# EAGLE design Tecleator (EAGLE 6.5.0)
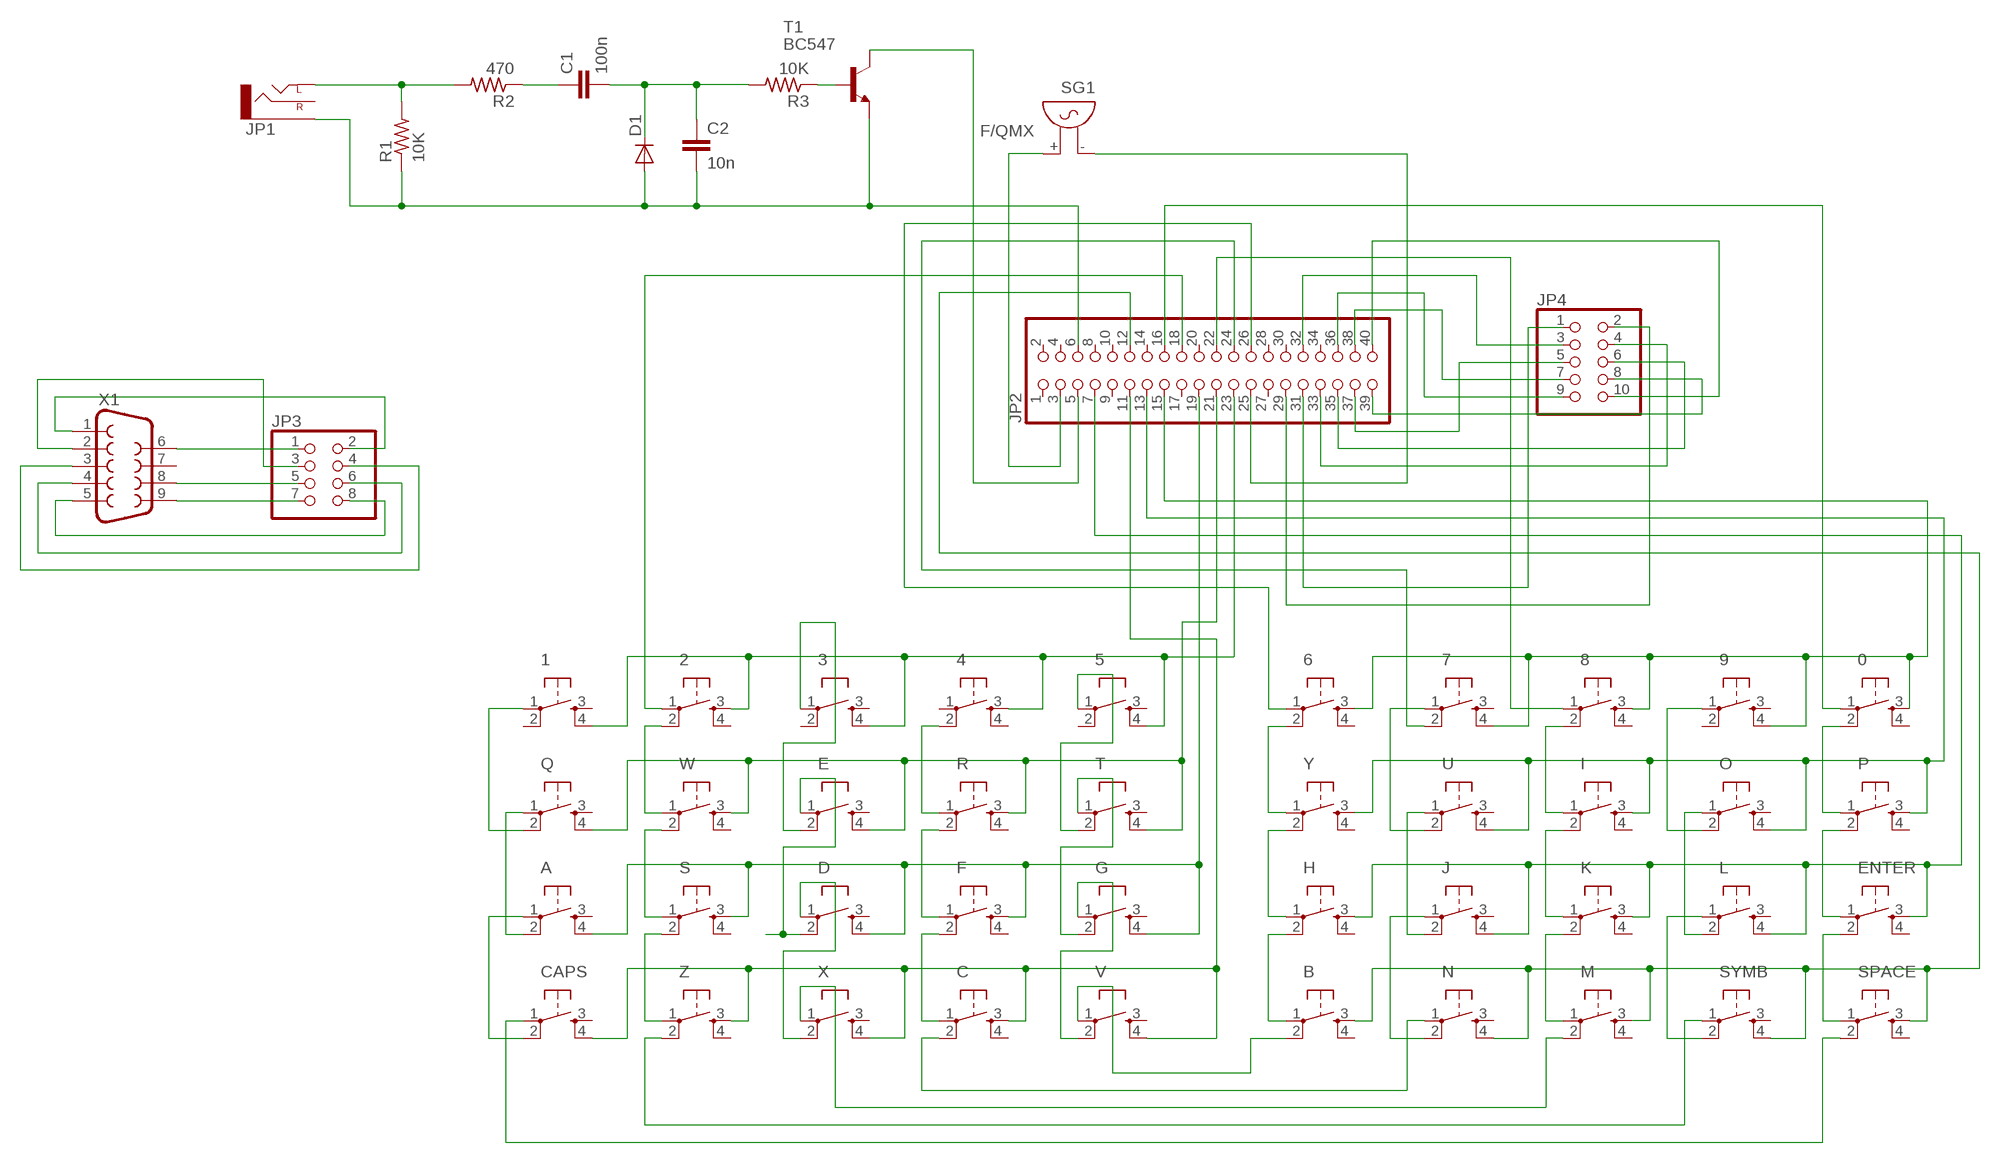
[diagram p0: schematic, sheet 1]

## Parts
0  DTS-6  [DTS-6]
1  DTS-6  [DTS-6]
2  DTS-6  [DTS-6]
3  DTS-6  [DTS-6]
4  DTS-6  [DTS-6]
5  DTS-6  [DTS-6]
6  DTS-6  [DTS-6]
7  DTS-6  [DTS-6]
8  DTS-6  [DTS-6]
9  DTS-6  [DTS-6]
A  DTS-6  [DTS-6]
B  DTS-6  [DTS-6]
C  DTS-6  [DTS-6]
C1  100n  C-EU050-025X075  [C050-025X075]
C2  10n  C-EU050-025X075  [C050-025X075]
CAPS  DTS-6  [DTS-6]
D  DTS-6  [DTS-6]
D1  DIODE-DO41-7.6  [DO41-7.6]
E  DTS-6  [DTS-6]
ENTER  DTS-6  [DTS-6]
F  DTS-6  [DTS-6]
G  DTS-6  [DTS-6]
H  DTS-6  [DTS-6]
I  DTS-6  [DTS-6]
J  DTS-6  [DTS-6]
JP1  AUDIO-JACKPTH  [AUDIO-JACK]
JP2  PINHD-2X20  [2X20]
JP3  PINHD-2X4  [2X04]
JP4  PINHD-2X5  [2X05]
K  DTS-6  [DTS-6]
L  DTS-6  [DTS-6]
M  DTS-6  [DTS-6]
N  DTS-6  [DTS-6]
O  DTS-6  [DTS-6]
P  DTS-6  [DTS-6]
Q  DTS-6  [DTS-6]
R  DTS-6  [DTS-6]
R1  10K  R-US_0204/7  [0204/7]
R2  470  R-US_0204/7  [0204/7]
R3  10K  R-US_0204/7  [0204/7]
S  DTS-6  [DTS-6]
SG1  F/QMX  [F/QMX]
SPACE  DTS-6  [DTS-6]
SYMB  DTS-6  [DTS-6]
T  DTS-6  [DTS-6]
T1  BC547  [TO92]
U  DTS-6  [DTS-6]
V  DTS-6  [DTS-6]
W  DTS-6  [DTS-6]
X  DTS-6  [DTS-6]
X1  DB9MALE  [DB9_MALE]
Y  DTS-6  [DTS-6]
Z  DTS-6  [DTS-6]

## Nets
A9: A.4 D.4 F.3 G.4 JP2.19 S.3
A10: E.4 JP2.21 Q.4 R.3 T.4 W.3
A11: 1.4 2.3 3.4 4.3 5.4 JP2.23
A12: 0.3 6.3 7.4 8.3 9.4 JP2.15
A13: I.3 JP2.13 O.4 P.3 U.4 Y.3
A14: ENTER.3 H.3 J.4 JP2.7 K.3 L.4
D1: 2.1 JP2.18
D2: 8.1 JP2.22
D3: 7.2 JP2.24
D4: 6.1 JP2.26
ELETE: M.2 X.1
N$1: CAPS.1 SPACE.2
N$2: 1.1 Q.2
N$3: K.2 M.1
N$4: C2.2 D1.A JP1.SLEEVE JP2.6 R1.1 T1.1(E)
N$5: JP1.TIP(LEFT) R1.2 R2.2
N$6: 0.1 JP2.16
N$7: A.2 Q.1
N$8: C1.1 R2.1
N$9: A.1 CAPS.2
N$10: B.1 H.2
N$11: H.1 Y.2
N$12: 6.2 Y.1
N$13: 3.1 E.2
N$14: S.1 W.2
N$15: S.2 Z.1
N$16: SYMB.1 Z.2
N$17: 5.1 T.2
N$18: 7.1 U.2
N$19: B.2 V.1
N$20: JP2.39 JP4.8
N$21: JP2.3 SG1.+
N$22: G.2 T.1
N$23: 4.2 R.1
N$24: F.1 R.2
N$25: C.1 F.2
N$26: G.1 V.2
N$27: J.2 U.1
N$28: J.1 N.2
N$29: C.3 CAPS.4 JP2.11 V.4 X.4 Z.3
N$30: JP2.25 SG1.-
N$31: D.2 E.1
N$32: 2.2 W.1
N$33: JP2.37 JP4.5
N$34: JP2.40 JP4.10
N$35: JP2.36 JP4.9
N$36: JP2.38 JP4.7
N$37: JP2.33 JP4.4
N$38: JP2.32 JP4.3
N$39: JP2.29 JP4.2
N$40: JP2.35 JP4.6
N$41: JP3.5 X1.8
N$42: JP2.31 JP4.1
N$43: C.2 N.1
N$44: L.1 SYMB.2
N$45: 9.1 O.2
N$46: JP3.6 X1.4
N$47: I.2 K.1
N$48: 8.2 I.1
N$49: L.2 O.1
N$50: JP3.1 X1.6
N$51: JP3.2 X1.1
N$52: ENTER.2 SPACE.1
N$53: ENTER.1 P.2
N$54: 0.2 P.1
N$55: JP3.3 X1.2
N$56: JP3.8 X1.5
N$59: JP3.7 X1.9
N$60: JP3.4 X1.3
N$69: C1.2 C2.1 D1.C R3.2
N$72: R3.1 T1.2(B)
N$73: JP2.5 T1.3(C)
N$74: D.1 X.2
VET: B.3 JP2.12 M.3 N.4 SPACE.3 SYMB.4
Unconnected: 0.4 1.2 1.3 2.4 3.2 3.3 4.1 4.4 5.2 5.3 6.4 7.3 8.4 9.2 9.3 A.3 B.4 C.4 CAPS.3 D.3 E.3 ENTER.4 F.4 G.3 H.4 I.4 J.3 JP1.RING(RIGHT) JP2.1 JP2.2 JP2.4 JP2.8 JP2.9 JP2.10 JP2.14 JP2.17 JP2.20 JP2.27 JP2.28 JP2.30 JP2.34 K.4 L.3 M.4 N.3 O.3 P.4 Q.3 R.4 S.4 SPACE.4 SYMB.3 T.3 U.3 V.3 W.4 X1.7 X.3 Y.4 Z.4

## Library data of the parts
0 1-9 A B C CAPS D E ENTER F G H I J K L M N O P Q R S SPACE SYMB T U V W X Y Z = switch-tact:DTS-6
C1 C2 = resistor:C-EU: CAPACITOR, European symbol
D1 = diode:DIODE-: DIODE
JP1 = SparkFun-Connectors:AUDIO-JACK: 3.5mm Audio Jack Simple 3.5mm common PCB mount audio jack. SKU: PRT-08032
JP2 = pinhead:PINHD-2X20: PIN HEADER
JP3 = pinhead:PINHD-2X4: PIN HEADER
JP4 = pinhead:PINHD-2X5: PIN HEADER
R1-R3 = resistor:R-US_: RESISTOR, American symbol
SG1 = buzzer:F/QMX: BUZZER Source: Buerklin; OC_FARNELL: unknown; OC_NEWARK: unknown
T1 = transistor:BC547: NPN TRANSISTOR
X1 = SparkFun-Connectors:DB9: DB9 Connector Standard DB9 (D-Sub 9) serial connector. Can be used for CAN bus as well as RS485 and RS232. Footprint production proven. Spark Fun Electronics SKU : PRT-00429

## Board
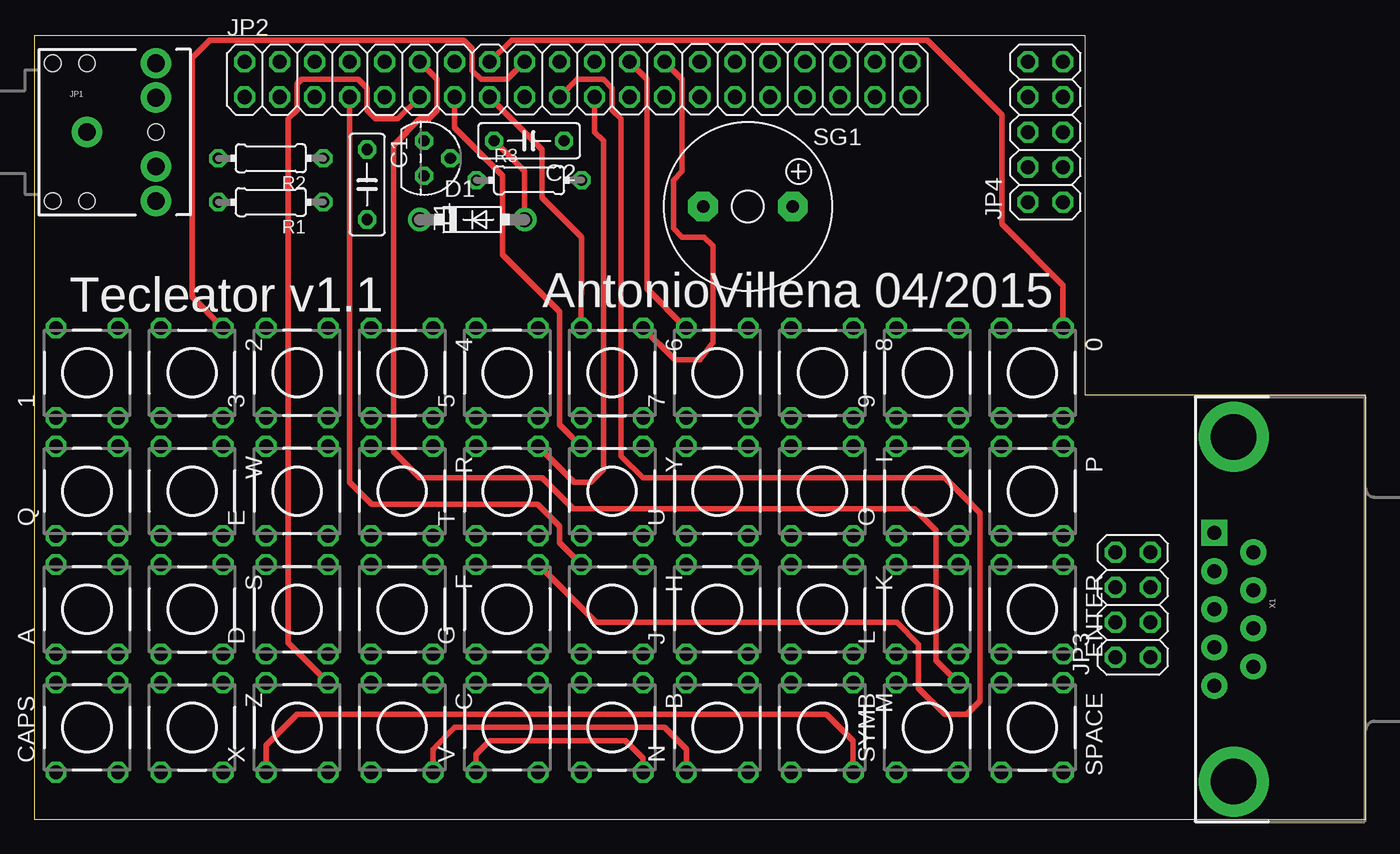
[diagram p1: board, top side]
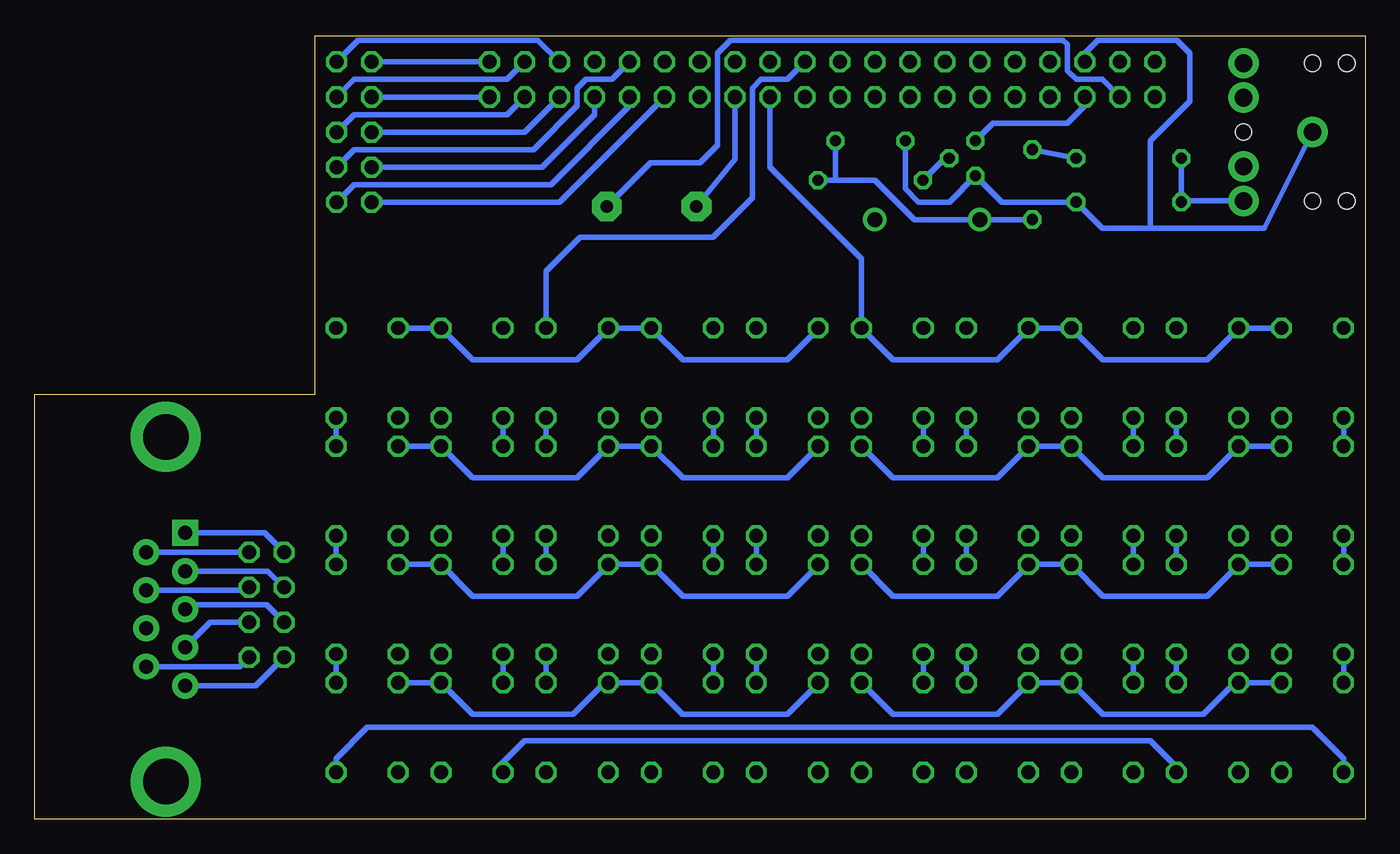
[diagram p2: board, bottom side, seen from below]

Size 96.52 x 56.83 mm. Coordinates in mm from the lower left corner, seen from the top.
Outline: 76.18,56.82 0,56.82 0,0 96.52,0 96.52,30.8 76.2,30.8 76.2,56.83
Copper layers (1*16): Top 0.035mm / dielectric 1.5mm / Bottom 0.035mm
Design rules "default": minimum track width 10mil, minimum drill 24mil, track to track 8mil, track to pad 8mil, pad to pad 8mil, via to via 8mil, smd to smd 8mil, copper to edge 40mil, drill to drill 8mil, minimum pad ring 10mil, minimum via ring 8mil, stop-mask expansion 4mil, vias tented up to drill 0mil, thermal gap 10mil

### Footprints (pad centres in the part's own frame; a part is rotated, then mirrored left to right if it is on the bottom)
DTS-6 = drill 1 octagon: 1 -3.25,2.25; 2 3.25,2.25; 3 -3.25,-2.25; 4 3.25,-2.25
C050-025X075 = drill 0.813 octagon: 1 -2.54,0; 2 2.54,0
DO41-7.6 = drill 1.1 pad 1.7: A 3.81,0; C -3.81,0
AUDIO-JACK = drill 1.3 pad 2.184: RING 5,5; RSH 5,2.5; SLEEVE 0,0; TIP 5,-5; TSH 5,-2.5 | hole 1.2: 0,5; -2.5,5; -2.5,-5; 0,-5; 5,0
2X20 = drill 1.016 octagon: 1 -24.13,-1.27; 2 -24.13,1.27; 3 -21.59,-1.27; 4 -21.59,1.27; 5 -19.05,-1.27; 6 -19.05,1.27; 7 -16.51,-1.27; 8 -16.51,1.27; 9 -13.97,-1.27; 10 -13.97,1.27; 11 -11.43,-1.27; 12 -11.43,1.27; 13 -8.89,-1.27; 14 -8.89,1.27; 15 -6.35,-1.27; 16 -6.35,1.27; 17 -3.81,-1.27; 18 -3.81,1.27; 19 -1.27,-1.27; 20 -1.27,1.27; 21 1.27,-1.27; 22 1.27,1.27; 23 3.81,-1.27; 24 3.81,1.27; 25 6.35,-1.27; 26 6.35,1.27; 27 8.89,-1.27; 28 8.89,1.27; 29 11.43,-1.27; 30 11.43,1.27; 31 13.97,-1.27; 32 13.97,1.27; 33 16.51,-1.27; 34 16.51,1.27; 35 19.05,-1.27; 36 19.05,1.27; 37 21.59,-1.27; 38 21.59,1.27; 39 24.13,-1.27; 40 24.13,1.27
2X04 = drill 1.016 octagon: 1 -3.81,-1.27; 2 -3.81,1.27; 3 -1.27,-1.27; 4 -1.27,1.27; 5 1.27,-1.27; 6 1.27,1.27; 7 3.81,-1.27; 8 3.81,1.27
2X05 = drill 1.016 octagon: 1 -5.08,-1.27; 2 -5.08,1.27; 3 -2.54,-1.27; 4 -2.54,1.27; 5 0,-1.27; 6 0,1.27; 7 2.54,-1.27; 8 2.54,1.27; 9 5.08,-1.27; 10 5.08,1.27
0204/7 = drill 0.813 octagon: 1 -3.81,0; 2 3.81,0
F/QMX = drill 0.914 pad 2.159 octagon: + 3.251,0; - -3.251,0
TO92 = drill 0.813 octagon: 1 1.27,0; 2 0,1.905; 3 -1.27,0
DB9_MALE = drill 1.016 pad 1.88: 1 5.54,-1.42; 2 2.77,-1.42; 3 0,-1.42; 4 -2.77,-1.42; 6 4.15,1.42; 7 1.38,1.42; 8 -1.38,1.42; 9 -4.15,1.42 | drill 1.016 pad 1.88 square: 5 -5.54,-1.42 | drill 3.302 pad 5.08: G1 -12.5,0; G2 12.5,0

### Placement (x,y rotation side)
0  72.39,32.38 270 top
1  3.81,32.38 90 top
2  11.43,32.38 270 top
3  19.05,32.38 90 top
4  26.67,32.38 270 top
5  34.29,32.38 90 top
6  41.91,32.38 270 top
7  49.53,32.38 90 top
8  57.15,32.38 270 top
9  64.77,32.38 90 top
A  3.81,15.24 90 top
B  41.91,6.67 270 top
C  26.67,6.67 270 top
C1  24.13,46.04 270 top
C2  35.88,49.21 180 top
CAPS  3.81,6.67 90 top
D  19.05,15.24 90 top
D1  31.75,43.5 0 top
E  19.05,23.81 90 top
ENTER  72.39,15.24 270 top
F  26.67,15.24 270 top
G  34.29,15.24 90 top
H  41.91,15.24 270 top
I  57.15,23.81 270 top
J  49.53,15.24 90 top
JP1  3.81,49.85 0 top
JP2  39.37,53.66 0 top
JP3  79.69,15.56 90 top
JP4  73.34,49.85 90 top
K  57.15,15.24 270 top
L  64.77,15.24 90 top
M  57.15,6.67 270 top
N  49.53,6.67 90 top
O  64.77,23.81 90 top
P  72.39,23.81 270 top
Q  3.81,23.81 90 top
R  26.67,23.81 270 top
R1  17.14,44.77 180 top
R2  17.14,47.94 180 top
R3  35.88,46.35 0 top
S  11.43,15.24 270 top
SG1  51.75,44.45 0 top
SPACE  72.39,6.67 270 top
SYMB  64.77,6.67 90 top
T  34.29,23.81 90 top
T1  28.26,47.94 270 top
U  49.53,23.81 90 top
V  34.29,6.67 90 top
W  11.43,23.81 270 top
X  19.05,6.67 90 top
X1  87,15.24 270 top
Y  41.91,23.81 270 top
Z  11.43,6.67 270 top

### Tracks (layer width: path | path; a pad name or v marks a point on that pad's centre or on a via)
A9
  Top 0.406: JP2.19 39.37,53.66 41.27,53.66 41.91,53.02 41.91,51.43 42.55,50.8 42.55,26.35 44.13,24.76 66.04,24.76 68.58,22.22 68.58,8.57 67.63,7.62 66.04,7.62 64.14,9.53 64.14,12.7 62.55,14.29 40.74,14.29 G.4
  Bottom 0.406: A.4 S.3 9.18,18.44 11.43,16.19 19,16.19 D.4 F.3 24.42,18.44 26.67,16.19 34.24,16.19 G.4
A10
  Top 0.406: T.4 39.16,24.45 40.32,24.45 41.27,25.4 41.27,49.21 40.64,49.85 JP2.21
  Bottom 0.406: Q.4 W.3 9.18,27.01 11.43,24.76 19,24.76 E.4 R.3 24.42,27.01 26.67,24.76 34.24,24.76 T.4
A11
  Bottom 0.406: 1.4 2.3 9.18,35.59 11.43,33.34 19,33.34 3.4 4.3 24.42,35.59 26.67,33.34 34.24,33.34 5.4 36.54,40.67 43.18,47.31 JP2.23
A12
  Top 0.406: JP2.15 36.83,48.58 36.83,45.09 39.69,42.23 39.69,40.42 6.3
  Bottom 0.406: 0.3 9.4 64.72,33.34 57.15,33.34 54.9,35.59 8.3 7.4 49.48,33.34 41.91,33.34 39.66,35.59 6.3
A13
  Top 0.406: JP2.13 30.48,50.17 33.97,46.67 33.97,40.96 38.1,36.83 38.1,28.62 Y.3
  Bottom 0.406: P.3 O.4 64.72,24.76 57.15,24.76 54.9,27.01 I.3 U.4 49.48,24.76 41.91,24.76 39.66,27.01 Y.3
A14
  Top 0.406: JP2.7 22.86,24.45 24.45,22.86 36.51,22.86 38.1,21.27 38.1,20.05 H.3
  Bottom 0.406: ENTER.3 L.4 64.72,16.19 57.15,16.19 54.9,18.44 K.3 J.4 49.48,16.19 41.91,16.19 39.66,18.44 H.3
D1
  Top 0.406: JP2.18 34.29,53.66 32.38,53.66 31.75,54.29 31.75,55.88 31.11,56.52 12.7,56.52 11.43,55.24 11.43,37.88 2.1
D2
  Bottom 0.406: JP2.22 41.91,53.66 43.81,53.66 44.45,53.02 44.45,45.09 47.31,42.23 56.94,42.23 59.4,39.76 8.1
D3
  Top 0.406: JP2.24 44.45,53.66 44.45,38.46 7.2
D4
  Top 0.406: JP2.26 46.99,53.66 46.99,46.99 46.35,46.35 46.35,42.86 46.99,42.23 48.58,42.23 49.21,41.59 49.21,34.61 48.26,33.34 46.46,33.34 6.1
ELETE
  Top 0.406: X.1 16.8,5.37 19.05,7.62 57.47,7.62 59.37,5.72 59.37,3.44 M.2
N$1
  Bottom 0.406: CAPS.1 1.56,4.42 3.81,6.67 72.39,6.67 74.64,4.42 SPACE.2
N$2
  Bottom 0.406: 1.1 Q.2
N$3
  Bottom 0.406: M.1 K.2
N$4
  Top 0.406: C2.2 35.56,46.99 D1.A
  Bottom 0.406: JP2.6 20.32,55.56 19.37,56.52 13.65,56.52 12.7,55.56 12.7,52.07 15.56,49.21 15.56,42.86 | C2.2 33.34,45.72 32.38,44.77 30.16,44.77 T1.1 26.35,44.77 R1.1 19.05,42.86 15.56,42.86 | JP1.SLEEVE 7.3,42.86 15.56,42.86
N$5
  Bottom 0.406: JP1.TIP 12.62,44.85 R1.2 R2.2
N$6
  Top 0.406: JP2.16 34.61,56.52 64.77,56.52 70.17,51.12 70.17,43.18 74.61,38.74 74.61,35.66 0.1
N$7
  Bottom 0.406: Q.1 A.2
N$8
  Bottom 0.406: R2.1 C1.1
N$9
  Bottom 0.406: A.1 CAPS.2
N$10
  Bottom 0.406: B.1 H.2
N$11
  Bottom 0.406: H.1 Y.2
N$12
  Bottom 0.406: Y.1 6.2
N$13
  Bottom 0.406: E.2 3.1
N$14
  Bottom 0.406: S.1 W.2
N$15
  Bottom 0.406: Z.1 S.2
N$16
  Bottom 0.406: Z.2 13.68,3.84 15.56,5.72 60.96,5.72 62.87,3.81 62.87,3.76 SYMB.1
N$17
  Bottom 0.406: T.2 5.1
N$18
  Bottom 0.406: U.2 7.1
N$19
  Top 0.406: V.1 32.04,4.73 33.02,5.72 42.86,5.72 44.13,4.44 44.13,3.44 B.2
N$20
  Bottom 0.406: JP2.39 JP4.8
N$21
  Bottom 0.406: JP2.3 19.05,53.66 20.95,53.66 21.59,54.29 21.59,56.2 21.91,56.52 46.04,56.52 46.99,55.56 46.99,48.89 48.26,47.63 51.83,47.63 SG1.+
N$22
  Bottom 0.406: G.2 T.1
N$23
  Bottom 0.406: R.1 4.2
N$24
  Bottom 0.406: F.1 R.2
N$25
  Bottom 0.406: C.1 F.2
N$26
  Bottom 0.406: V.2 G.1
N$27
  Bottom 0.406: J.2 U.1
N$28
  Bottom 0.406: N.2 J.1
N$29
  Top 0.406: X.4 18.41,12.8 18.41,50.8 19.05,51.43 19.05,53.34 19.37,53.66 23.5,53.66 24.13,53.02 24.13,51.43 24.77,50.8 26.35,50.8 JP2.11
  Bottom 0.406: CAPS.4 Z.3 9.45,9.92 11.75,7.62 19.05,7.62 19.05,7.67 X.4 C.3 24.42,9.87 26.67,7.62 34.24,7.62 V.4
N$30
  Bottom 0.406: JP2.25 45.72,47.87 SG1.-
N$31
  Bottom 0.406: D.2 E.1
N$32
  Bottom 0.406: W.1 2.2
N$33
  Bottom 0.406: JP2.37 62.23,51.12 73.34,51.12 JP4.5
N$34
  Bottom 0.406: JP2.40 JP4.10
N$35
  Bottom 0.406: JP2.36 60.01,56.52 73.03,56.52 JP4.9
N$36
  Bottom 0.406: JP2.38 62.23,53.66 73.34,53.66 JP4.7
N$37
  Bottom 0.406: JP2.33 55.88,51.12 59.69,47.31 JP4.4
N$38
  Bottom 0.406: JP2.32 54.61,53.66 56.52,53.66 57.15,53.02 57.15,51.75 60.33,48.58 73.34,48.58 JP4.3
N$39
  Bottom 0.406: JP4.2 58.42,44.77 JP2.29
N$40
  Bottom 0.406: JP2.35 60.96,49.85 JP4.6
N$41
  Bottom 0.406: X1.8 80.96,16.62 JP3.5
N$42
  Bottom 0.406: JP4.1 73.34,46.04 59.05,46.04 53.34,51.75 JP2.31
N$43
  Top 0.406: C.2 28.92,5.11 30.48,6.67 45.72,6.67 47.31,5.08 47.31,3.44 N.1
N$44
  Bottom 0.406: SYMB.2 L.1
N$45
  Bottom 0.406: O.2 9.1
N$46
  Bottom 0.406: X1.4 79.61,18.01 JP3.6
N$47
  Bottom 0.406: K.1 I.2
N$48
  Bottom 0.406: I.1 8.2
N$49
  Bottom 0.406: L.2 O.1
N$50
  Bottom 0.406: X1.6 81.62,11.09 JP3.1
N$51
  Bottom 0.406: X1.1 80.47,9.7 JP3.2
N$52
  Bottom 0.406: SPACE.1 ENTER.2
N$53
  Bottom 0.406: ENTER.1 P.2
N$54
  Bottom 0.406: P.1 0.2
N$55
  Bottom 0.406: JP3.3 83.76,14.29 X1.2
N$56
  Bottom 0.406: X1.5 79.83,20.78 JP3.8
N$59
  Bottom 0.406: JP3.7 88.42,19.37 X1.9
N$60
  Bottom 0.406: X1.3 85.41,15.24 85.09,15.56 79.69,15.56 JP3.4
N$69
  Bottom 0.406: C1.2 D1.C 32.7,43.5 35.56,46.35 38.42,46.35 | R3.2 38.42,46.35 | C2.1 38.42,46.35
N$72
  Bottom 0.406: T1.2 30.48,47.94 R3.1
N$73
  Bottom 0.406: JP2.5 20.32,51.75 21.59,50.48 26.99,50.48 T1.3
N$74
  Bottom 0.406: X.2 D.1
VET
  Top 0.406: SYMB.4 65.41,11.53 65.41,20.95 63.82,22.54 39.05,22.54 36.83,24.76 27.94,24.76 26.04,26.67 26.04,48.89 27.94,50.8 28.57,50.8 29.21,51.43 29.21,53.66 JP2.12
  Bottom 0.406: SPACE.3 SYMB.4 64.72,7.62 57.47,7.62 55.17,9.92 M.3 N.4 49.53,7.67 49.53,7.62 41.91,7.62 39.66,9.87 B.3

### Text on the board
tNames: AntonioVillena 04/2015 | Tecleator v1.1